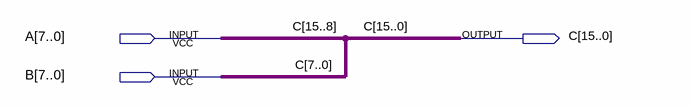
[diagram p0: schematic sheet]
// Quartus schematic bus8_bus16.bdf as structural Verilog: 0 symbols, 3 pins
module bus8_bus16 (
  input  [7:0] A,
  input  [7:0] B,
  output [15:0] C
);


  assign C = {A, B};
endmodule
